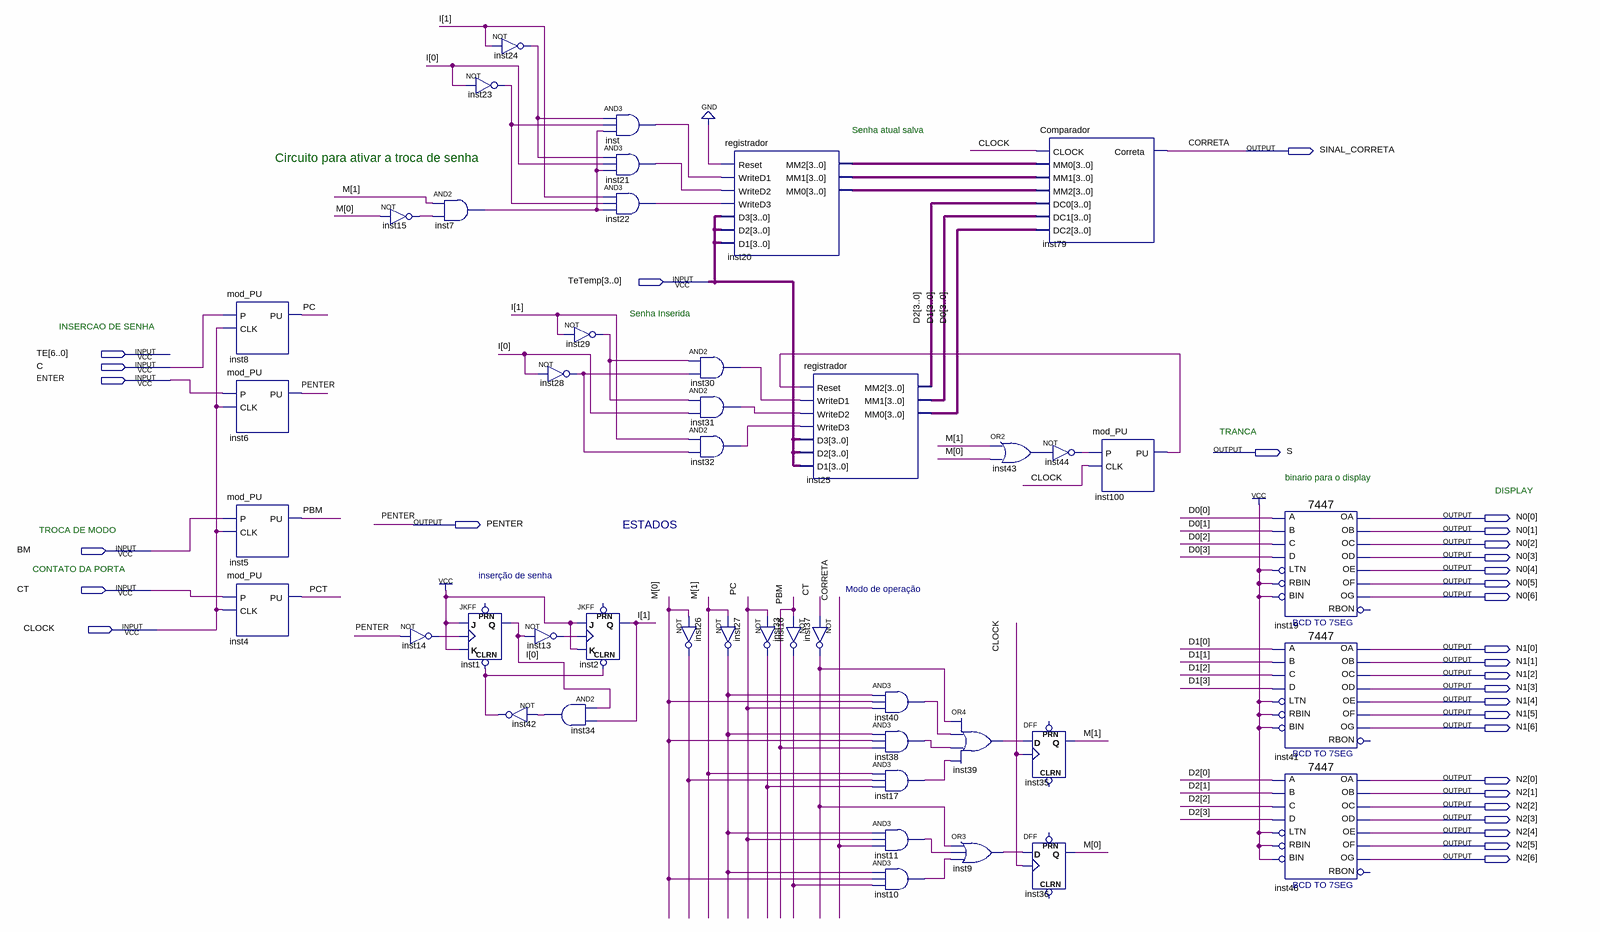
[diagram p0: schematic sheet]
// Quartus schematic Cofre.bdf as structural Verilog: 45 symbols, 31 pins
module Cofre (
  input  [3:0] TeTemp,
  input  [6:0] TE,
  input  C,
  input  ENTER,
  input  BM,
  input  CT,
  input  CLOCK,
  output SINAL_CORRETA,
  output S,
  output [6:0] N0,
  output PENTER,
  output [6:0] N1,
  output [6:0] N2
);

  wire inst7_out, inst9_out, inst10_out, inst11_out, inst13_out, inst14_out, inst15_out, inst16_out,
       inst17_out, inst21_out, inst22_out, inst23_out, inst24_out, inst26_out, inst27_out, inst28_out,
       inst29_out, inst30_out, inst31_out, inst32_out, inst33_out, inst34_out, inst37_out, inst38_out,
       inst39_out, inst40_out, inst42_out, inst43_out, inst44_out, inst100_pu, inst_out, PBM, PC, PCT;
  wire [1:0] I, M;
  wire [3:0] D0, D1, D2, inst20_mm0, inst20_mm1, inst20_mm2;

  mod_PU inst8 (.P(C), .CLK(CLOCK), .PU(PC));
  mod_PU inst6 (.P(ENTER), .CLK(CLOCK), .PU(PENTER));
  mod_PU inst5 (.P(BM), .CLK(CLOCK), .PU(PBM));
  mod_PU inst4 (.P(CT), .CLK(CLOCK), .PU(PCT));
  not inst15 (inst15_out, M[0]);
  not inst14 (inst14_out, PENTER);
  and inst7 (inst7_out, M[1], inst15_out);
  not inst24 (inst24_out, I[1]);
  not inst23 (inst23_out, I[0]);
  JKFF inst1 (.CLRN(inst42_out), .K(1'b1), .J(1'b1), .CLK(inst14_out), .Q(I[0]));  // open: PRN
  not inst42 (inst42_out, inst34_out);
  not inst28 (inst28_out, I[0]);
  not inst13 (inst13_out, I[0]);
  and inst34 (inst34_out, I[0], I[1]);
  and inst (inst_out, inst24_out, inst23_out, inst7_out);
  and inst21 (inst21_out, inst24_out, I[0], inst7_out);
  and inst22 (inst22_out, I[1], inst23_out, inst7_out);
  not inst29 (inst29_out, I[1]);
  JKFF inst2 (.CLRN(inst42_out), .K(1'b1), .J(1'b1), .CLK(inst13_out), .Q(I[1]));  // open: PRN
  and inst30 (inst30_out, inst29_out, inst28_out);
  and inst31 (inst31_out, inst29_out, I[0]);
  and inst32 (inst32_out, I[1], inst28_out);
  not inst26 (inst26_out, M[0]);
  not inst27 (inst27_out, M[1]);
  registrador inst20 (
    .Reset(1'b0), .WriteD1(inst_out), .WriteD2(inst21_out), .WriteD3(inst22_out), .D3(TeTemp), .D2(TeTemp),
    .D1(TeTemp), .MM2(inst20_mm2), .MM1(inst20_mm1), .MM0(inst20_mm0));
  not inst33 (inst33_out, PC);
  registrador inst25 (
    .Reset(inst100_pu), .WriteD1(inst30_out), .WriteD2(inst31_out), .WriteD3(inst32_out), .D3(TeTemp),
    .D2(TeTemp), .D1(TeTemp), .MM2(D2), .MM1(D1), .MM0(D0));
  not inst37 (inst37_out, CT);
  not inst16 (inst16_out, PBM);
  and inst40 (inst40_out, inst27_out, M[0], PC);
  and inst38 (inst38_out, inst27_out, M[0], PBM);
  and inst17 (inst17_out, M[1], inst26_out, inst33_out);
  and inst11 (inst11_out, inst27_out, PC, SINAL_CORRETA);
  and inst10 (inst10_out, inst27_out, M[0], inst16_out);
  or inst39 (inst39_out, inst37_out, inst40_out, inst38_out, inst17_out);
  or inst9 (inst9_out, inst37_out, inst11_out, inst10_out);
  or inst43 (inst43_out, M[1], M[0]);
  DFF inst35 (.CLK(CLOCK), .D(inst39_out), .Q(M[1]));  // open: CLRN, PRN
  DFF inst36 (.CLK(CLOCK), .D(inst9_out), .Q(M[0]));  // open: CLRN, PRN
  Comparador inst79 (
    .CLOCK(CLOCK), .MM0(inst20_mm2), .MM1(inst20_mm1), .MM2(inst20_mm0), .DC0(D2), .DC1(D1), .DC2(D0),
    .Correta(SINAL_CORRETA));
  not inst44 (inst44_out, inst43_out);
  mod_PU inst100 (.P(inst44_out), .CLK(CLOCK), .PU(inst100_pu));
  \7447  inst19 (
    .LTN(1'b1), .B(D0[1]), .C(D0[2]), .D(D0[3]), .RBIN(1'b1), .BIN(1'b1), .A(D0[0]), .OB(N0[1]), .OC(N0[2]),
    .OE(N0[4]), .OD(N0[3]), .OF(N0[5]), .OG(N0[6]), .OA(N0[0]));  // open: RBON
  \7447  inst41 (
    .LTN(1'b1), .B(D1[1]), .C(D1[2]), .D(D1[3]), .RBIN(1'b1), .BIN(1'b1), .A(D1[0]), .OB(N1[1]), .OC(N1[2]),
    .OE(N1[4]), .OD(N1[3]), .OF(N1[5]), .OG(N1[6]), .OA(N1[0]));  // open: RBON
  \7447  inst46 (
    .LTN(1'b1), .B(D2[1]), .C(D2[2]), .D(D2[3]), .RBIN(1'b1), .BIN(1'b1), .A(D2[0]), .OB(N2[1]), .OC(N2[2]),
    .OE(N2[4]), .OD(N2[3]), .OF(N2[5]), .OG(N2[6]), .OA(N2[0]));  // open: RBON

  // Other names for the same wires on the sheet: CORRETA = SINAL_CORRETA

  // Notes on the sheet:
  //   Senha atual salva
  //   Circuito para ativar a troca de senha
  //   Senha Inserida
  //   INSERCAO DE SENHA
  //   TRANCA
  //   binario para o display
  //   DISPLAY
  //   ESTADOS
  //   TROCA DE MODO
  //   CONTATO DA PORTA
  //   inserção de senha
  //   Modo de operação
endmodule
